# EAGLE design billdetect_ring2a (EAGLE 6.6.0)
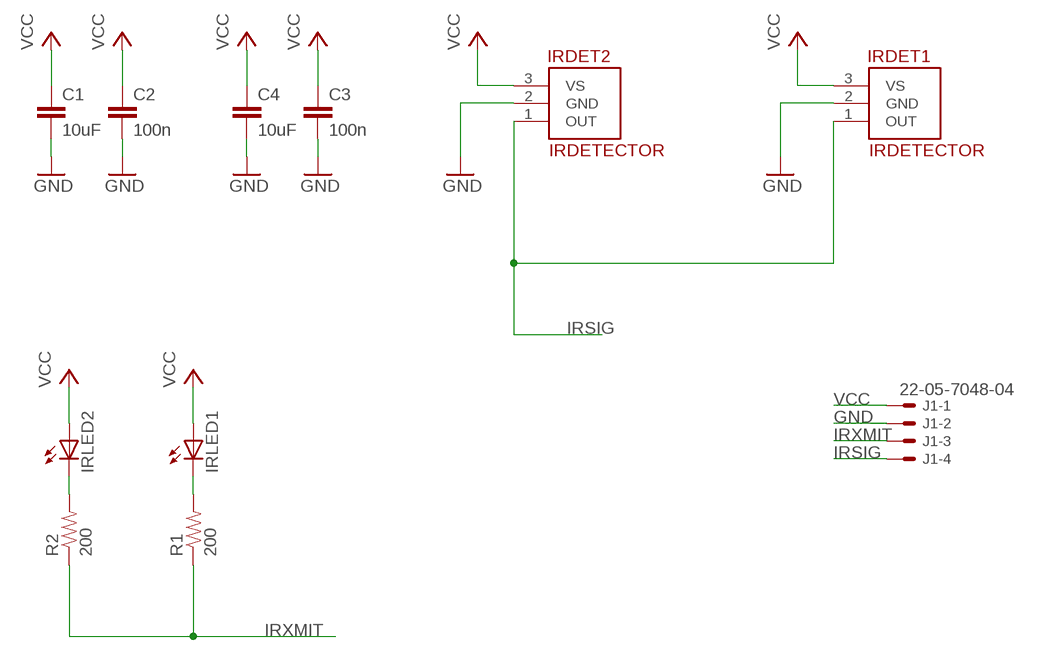
[diagram p0: schematic, sheet 1]

## Parts
C1  10uF  CAP0805  [0805]
C2  100n  CAP0805  [0805]
C3  100n  CAP0805  [0805]
C4  10uF  CAP0805  [0805]
IRDET1  IRDETECTOR  [TSOP-3PIN-2.54MM]
IRDET2  IRDETECTOR  [TSOP-3PIN-2.54MM]
IRLED1  LED-5MM-90DEG  [LED-5MM-90DEG]
IRLED2  LED-5MM-90DEG  [LED-5MM-90DEG]
J1  22-05-7048-04  [7395-04]
R1  200  RESISTOR0805-RES  [0805]
R2  200  RESISTOR0805-RES  [0805]

## Nets
GND: C1.2 C2.2 C3.2 C4.2 IRDET1.2(GND) IRDET2.2(GND) J1.2
IRSIG: IRDET1.1(OUT) IRDET2.1(OUT) J1.4
IRXMIT: J1.3 R1.1 R2.1
N$1: IRLED2.K(C) R2.2
N$3: IRLED1.K(C) R1.2
VCC: C1.1 C2.1 C3.1 C4.1 IRDET1.3(VS) IRDET2.3(VS) IRLED1.A IRLED2.A J1.1

## Library data of the parts
C1-C4 = SparkFun-20110517:CAP: Capacitor Standard 0603 ceramic capacitor, and 0.1" leaded capacitor.
IRDET1 IRDET2 = todstuff:IRDETECTOR: Vishay TSOP348.., TSOP344.. IR receiver modules CARRIER FREQUENCY STD (AGC2,AGC8) NOISY ENV(AGC4) 30 kHz TSOP34830 TSOP34430 33 kHz TSOP34833 TSOP34433 36 kHz TSOP34836 TSOP34436 38 kHz TSOP34838 TSOP34438 40 kHz TSOP34840 TSOP34440 56 kHz TSOP34856 TSOP34456
IRLED1 IRLED2 = dp_devices:LED: Light Emitting Diode
J1 = con-molex:22-?-04: CONNECTOR wire to board 2.54 mm (.1 inch) pitch header; OC_FARNELL: unknown; OC_NEWARK: unknown
R1 R2 = SparkFun-Passives:RESISTOR: Resistor Basic schematic elements and footprints for 0603, 1206, and PTH resistors.

## Board
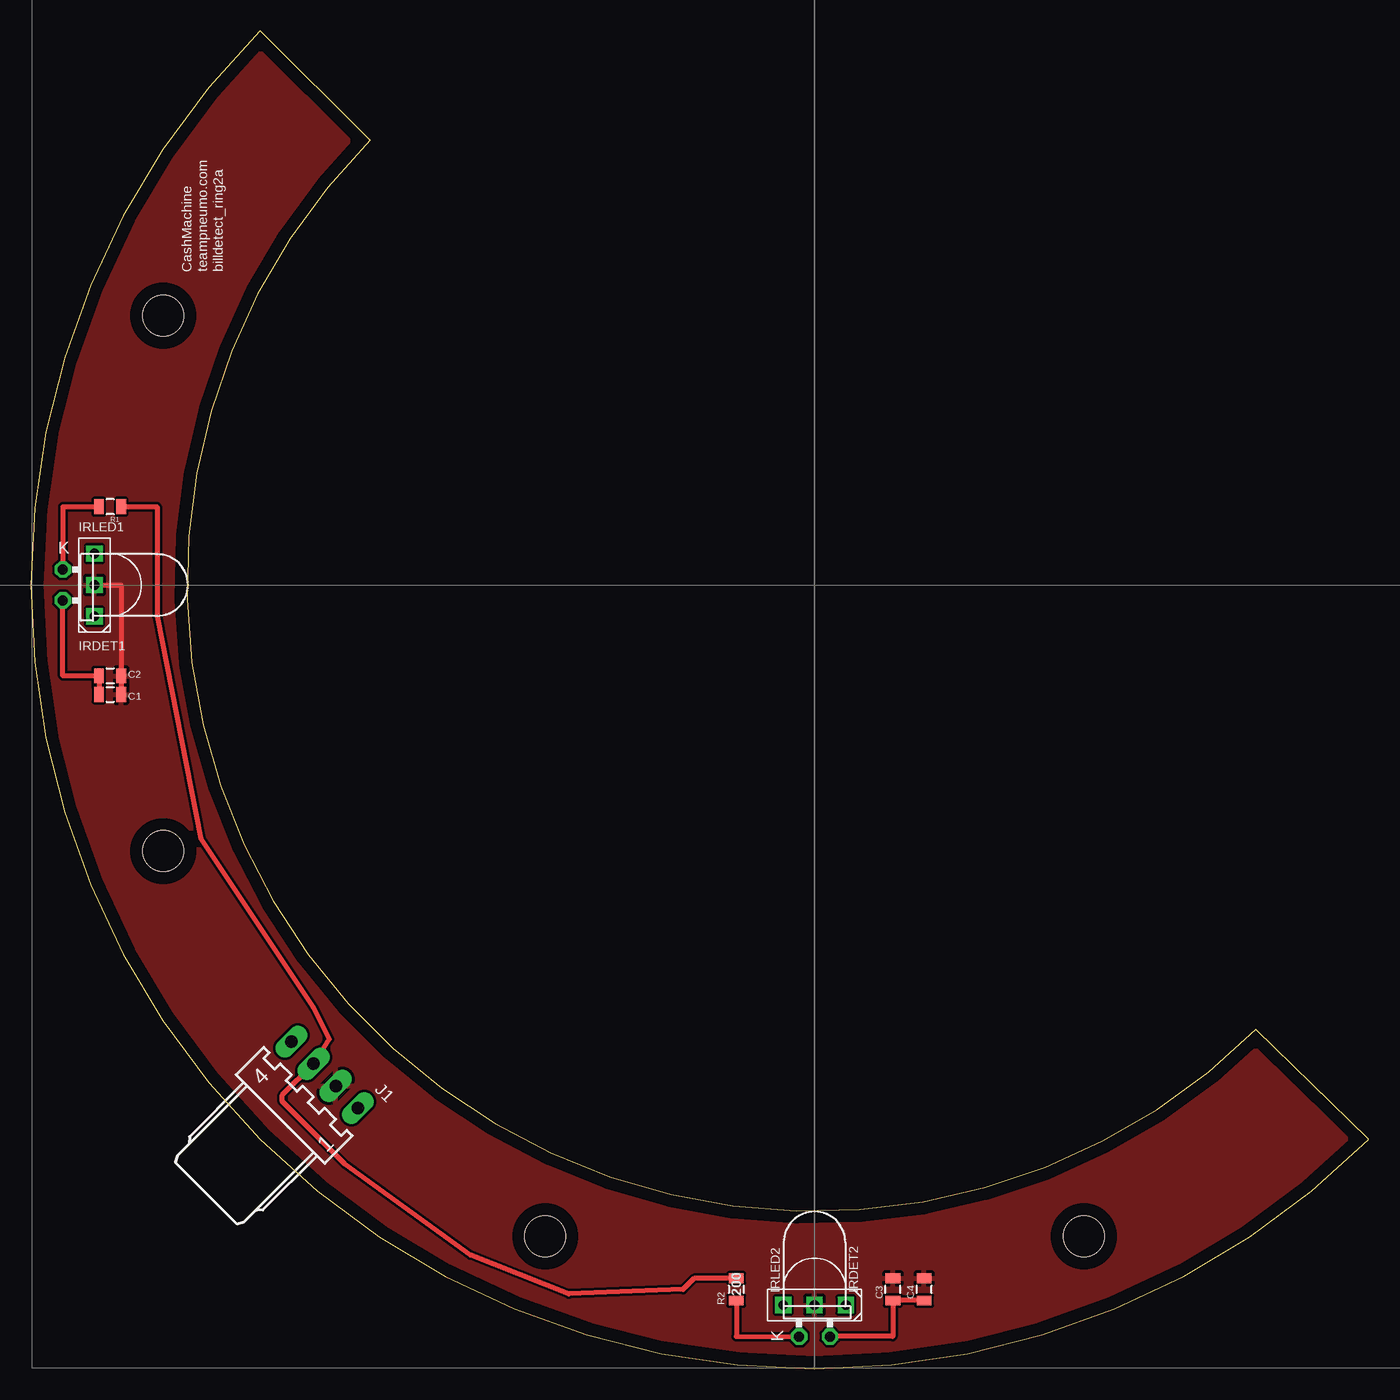
[diagram p1: board, top side]
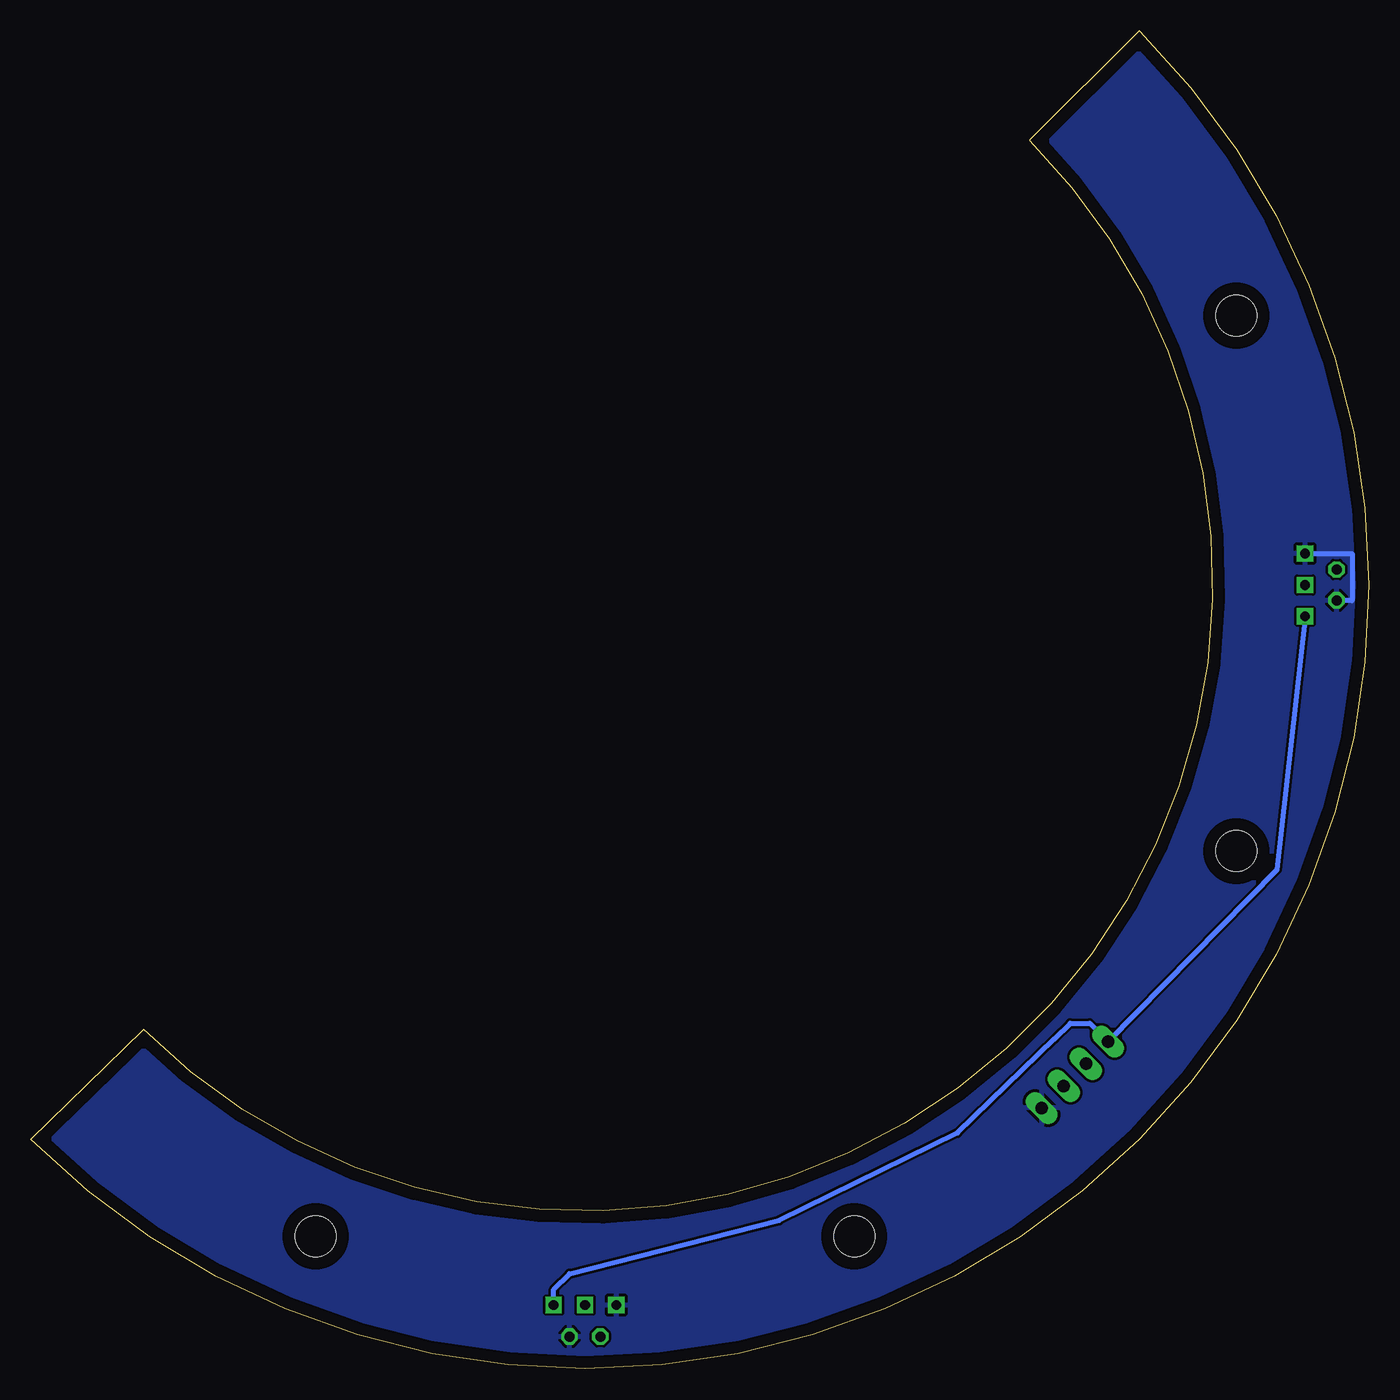
[diagram p2: board, bottom side, seen from below]

Size 108.54 x 108.54 mm. Coordinates in mm from the lower left corner, seen from the top.
Outline: 27.51,99.65 arc180 99.39,27.51 108.54,18.62 arc-180 18.62,108.54 27.51,99.65
Copper layers (1*16): Top 0.035mm / dielectric 1.5mm / Bottom 0.035mm
Design rules "default": minimum track width 10mil, minimum drill 24mil, track to track 8mil, track to pad 8mil, pad to pad 8mil, via to via 8mil, smd to smd 8mil, copper to edge 40mil, drill to drill 8mil, minimum pad ring 10mil, minimum via ring 8mil, stop-mask expansion 4mil, vias tented up to drill 0mil, thermal gap 10mil

### Footprints (pad centres in the part's own frame; a part is rotated, then mirrored left to right if it is on the bottom)
0805 = smd 0.8 x 1.2: 1 -0.9,0; 2 0.9,0
TSOP-3PIN-2.54MM = drill 0.8 square: 1 5.08,0; 2 2.54,0; 3 0,0
LED-5MM-90DEG = drill 0.813 octagon: A 5.1,1.25; K 5.1,-1.25
7395-04 = drill 1.016 long: 1 3.81,0; 2 1.27,0; 3 -1.27,0; 4 -3.81,0
STAND-OFF = hole 3.302: 0,0

### Placement (x,y rotation side)
C1  6.43,54.69 0 top
C2  6.43,56.21 0 top
C3  69.93,6.43 90 top
C4  72.47,6.43 90 top
IRDET1  5.16,66.12 270 top
IRDET2  61.04,5.16 0 top
IRLED1  7.7,63.58 180 top
IRLED2  63.58,7.7 270 top
J1  23.84,23.84 315 top
R1  6.43,69.93 180 top
R2  57.23,6.43 270 top
U$1  [STAND-OFF]  85.42,10.75 0 top
U$3  [STAND-OFF]  10.75,85.42 0 top
U$5  [STAND-OFF]  10.75,41.99 0 top
U$6  [STAND-OFF]  41.74,10.75 0 top

### Tracks (layer width: path | path; a pad name or v marks a point on that pad's centre or on a via)
GND
  Top 0.406: C1.2 C2.2 7.33,63.58 IRDET1.2
  pour Top: -2.21,79.07 -2.46,-2.46 105.49,-2.46 111.59,17.86 18.11,111.08
IRSIG
  Bottom 0.406: IRDET1.1 7.45,40.47 J1.4 22.63,28.02 24.21,28.02 25.48,26.75 33.35,19.13 47.83,12.02 64.85,7.7 66.12,6.43 IRDET2.1
IRXMIT
  Top 0.406: R1.1 10.24,69.93 10.24,61.04 13.8,43.01 22.94,29.29 24.21,26.75 J1.3 20.4,22.2 20.4,21.67 25.48,16.59 35.64,9.22 43.63,6.06 52.91,6.43 53.81,7.33 R2.1
N$1
  Top 0.406: R2.2 57.23,2.62 IRLED2.K
N$3
  Top 0.406: IRLED1.K 2.62,64.83 2.62,69.93 R1.2
VCC
  Top 0.406: C1.1 C2.1 2.6,56.21 IRLED1.A | C4.1 C3.1 69.93,2.62 64.85,2.62 IRLED2.A
  Bottom 0.406: IRDET1.3 1.35,66.12 1.35,62.31 2.6,62.31 IRLED1.A
  pour Bottom: 19.13,110.57 109.3,20.4 109.3,10.24 96.6,-2.46 -1.19,-2.46 -1.19,91.52 17.86,110.57

### Text on the board
tPlace: teampneumo.com
tNames: CashMachine | billdetect_ring2a
Document: CashMachine | Sensor Board v2 | teampneumo.com | todbot.com